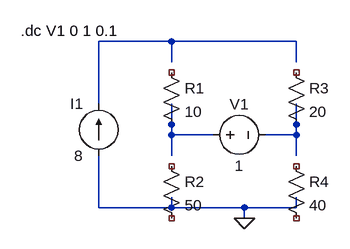
[diagram p0: schematic Ex_04_80.asc]
Ex_04_80.asc, the LTspice schematic file:
Version 4.1
SHEET 1 880 680
WIRE 112 32 0 32
WIRE 304 32 112 32
WIRE 112 64 112 32
WIRE 304 64 304 32
WIRE 0 128 0 32
WIRE 112 176 112 128
WIRE 176 176 112 176
WIRE 304 176 304 128
WIRE 304 176 256 176
WIRE 112 208 112 176
WIRE 304 208 304 176
WIRE 0 288 0 208
WIRE 112 288 112 272
WIRE 112 288 0 288
WIRE 224 288 112 288
WIRE 304 288 304 272
WIRE 304 288 224 288
WIRE 224 304 224 288
FLAG 224 304 0
SYMBOL current 0 208 R180
WINDOW 0 24 80 Left 2
WINDOW 3 24 0 Left 2
WINDOW 123 0 0 Left 0
WINDOW 39 0 0 Left 0
SYMATTR InstName I1
SYMATTR Value 8
SYMBOL res 96 64 R0
SYMATTR InstName R1
SYMATTR Value 10
SYMBOL res 96 208 R0
SYMATTR InstName R2
SYMATTR Value 50
SYMBOL res 288 64 R0
SYMATTR InstName R3
SYMATTR Value 20
SYMBOL res 288 208 R0
SYMATTR InstName R4
SYMATTR Value 40
SYMBOL voltage 160 176 R270
WINDOW 0 32 56 VTop 2
WINDOW 3 -32 56 VBottom 2
WINDOW 123 0 0 Left 0
WINDOW 39 0 0 Left 0
SYMATTR InstName V1
SYMATTR Value 1
TEXT -120 16 Left 2 !.dc V1 0 1 0.1

The netlist it stands for:
* Ex_04_80.asc
I1 0 N001 8
R1 NC_01 N002 10
R2 NC_02 NC_03 50
R3 NC_04 N003 20
R4 NC_05 NC_06 40
V1 N002 N003 1
.dc V1 0 1 0.1
.backanno
.end